# Altium schematic sheet OVP.SchDoc
size A; SheetNumber: 13; SheetTotal: 21
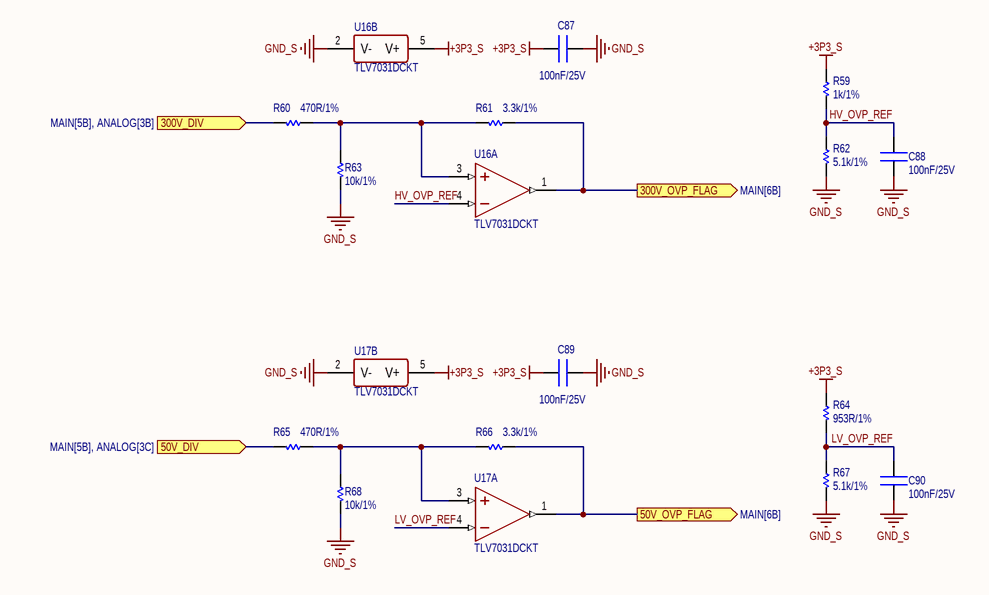
[diagram p0: OVP.SchDoc]

## Parts
C87  100nF/25V  [CN-SMD-0603]
C88  100nF/25V  [CN-SMD-0603]
C89  100nF/25V  [CN-SMD-0603]
C90  100nF/25V  [CN-SMD-0603]
R59  1k/1%  [RES-SMD-0603]
R60  470R/1%  [RES-SMD-0603]
R61  3.3k/1%  [RES-SMD-0603]
R62  5.1k/1%  [RES-SMD-0603]
R63  10k/1%  [RES-SMD-0603]
R64  953R/1%  [RES-SMD-0603]
R65  470R/1%  [RES-SMD-0603]
R66  3.3k/1%  [RES-SMD-0603]
R67  5.1k/1%  [RES-SMD-0603]
R68  10k/1%  [RES-SMD-0603]
U16  TLV7031DCKT  [SOT353]  (parts A,B of 2)
U17  TLV7031DCKT  [SOT353]  (parts A,B of 2)

## Ports
50V_DIV (in, see MAIN[5B], ANALOG[3C]), 50V_OVP_FLAG (out, see MAIN[6B]), 300V_DIV (in, see MAIN[5B], ANALOG[3B]), 300V_OVP_FLAG (out, see MAIN[6B])

## Nets
+3P3_S: C87.1 C89.1 R59.1 R64.1 U16.5(V+) U17.5(V+)
GND_S: C87.2 C88.1 C89.2 C90.1 R62.2 R63.2 R67.2 R68.2 U16.2(V-) U17.2(V-)
50V_DIV: R65.2 ; port 50V_DIV
50V_OVP_FLAG: R66.1 U17.1(OUT) ; port 50V_OVP_FLAG
300V_DIV: R60.2 ; port 300V_DIV
300V_OVP_FLAG: R61.1 U16.1(OUT) ; port 300V_OVP_FLAG
HV_OVP_REF: C88.2 R59.2 R62.1 U16.4(IN-)
LV_OVP_REF: C90.2 R64.2 R67.1 U17.4(IN-)
NetR60_1: R60.1 R61.2 R63.1 U16.3(IN+)
NetR65_1: R65.1 R66.2 R68.1 U17.3(IN+)

## Library data of the parts
C87-C90 = CN: CL10B104KA8NNNC; PN: CL10B104KA8NNNC
R59 = Res-SMD: ERJ-3EKF1001V; Manufacturer: Generic Components; Class: Passive; PN: ERJ-3EKF1001V; Publisher: Altium Hobart Technology Centre
R60 R65 = Res-SMD: ERJ-1GJF4700C; Manufacturer: Generic Components; Class: Passive; PN: ERJ-1GJF4700C; Publisher: Altium Hobart Technology Centre
R61 R66 = Res-SMD: ERJ-3EKF3301V; Manufacturer: Generic Components; Class: Passive; PN: ERJ-3EKF3301V; Publisher: Altium Hobart Technology Centre
R62 R67 = Res-SMD: ERJ-3EKF5101V; Manufacturer: Generic Components; Class: Passive; PN: ERJ-3EKF5101V; Publisher: Altium Hobart Technology Centre
R63 R68 = Res-SMD: ERJ-3EKF1002V; Manufacturer: Generic Components; Class: Passive; PN: ERJ-3EKF1002V; Publisher: Altium Hobart Technology Centre
R64 = Res-SMD: ERJ-3EKF9530V; Manufacturer: Generic Components; Class: Passive; PN: ERJ-3EKF9530V; Publisher: Altium Hobart Technology Centre
U16 U17 = OPA340DBV: PN: TLV7031DCKT